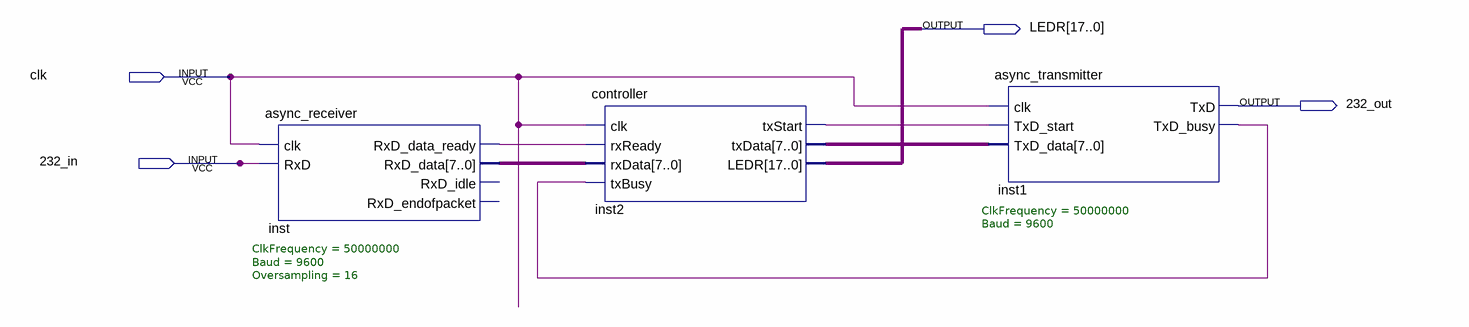
[diagram p0: schematic sheet]
// Quartus schematic serial.bdf as structural Verilog: 3 symbols, 4 pins
module serial (
  input  clk,
  input  \232_in ,
  output [17:0] LEDR,
  output \232_out 
);

  wire inst1_txd_busy, inst2_txstart, inst_rxd_data_ready;
  wire [7:0] inst2_txdata, inst_rxd_data;

  async_receiver #(.ClkFrequency(50000000), .Baud(9600), .Oversampling(16)) inst (
    .clk(clk), .RxD(\232_in ), .RxD_data_ready(inst_rxd_data_ready), .RxD_data(inst_rxd_data));  // open: RxD_idle, RxD_endofpacket
  controller inst2 (
    .clk(clk), .rxReady(inst_rxd_data_ready), .rxData(inst_rxd_data), .txBusy(inst1_txd_busy),
    .txStart(inst2_txstart), .txData(inst2_txdata), .LEDR(LEDR));
  async_transmitter #(.ClkFrequency(50000000), .Baud(9600)) inst1 (
    .clk(clk), .TxD_start(inst2_txstart), .TxD_data(inst2_txdata), .TxD(\232_out ), .TxD_busy(inst1_txd_busy));
endmodule
